# EAGLE design Trans Main Board ESP32 NEW Rev1.2 (EAGLE 9.6.2)
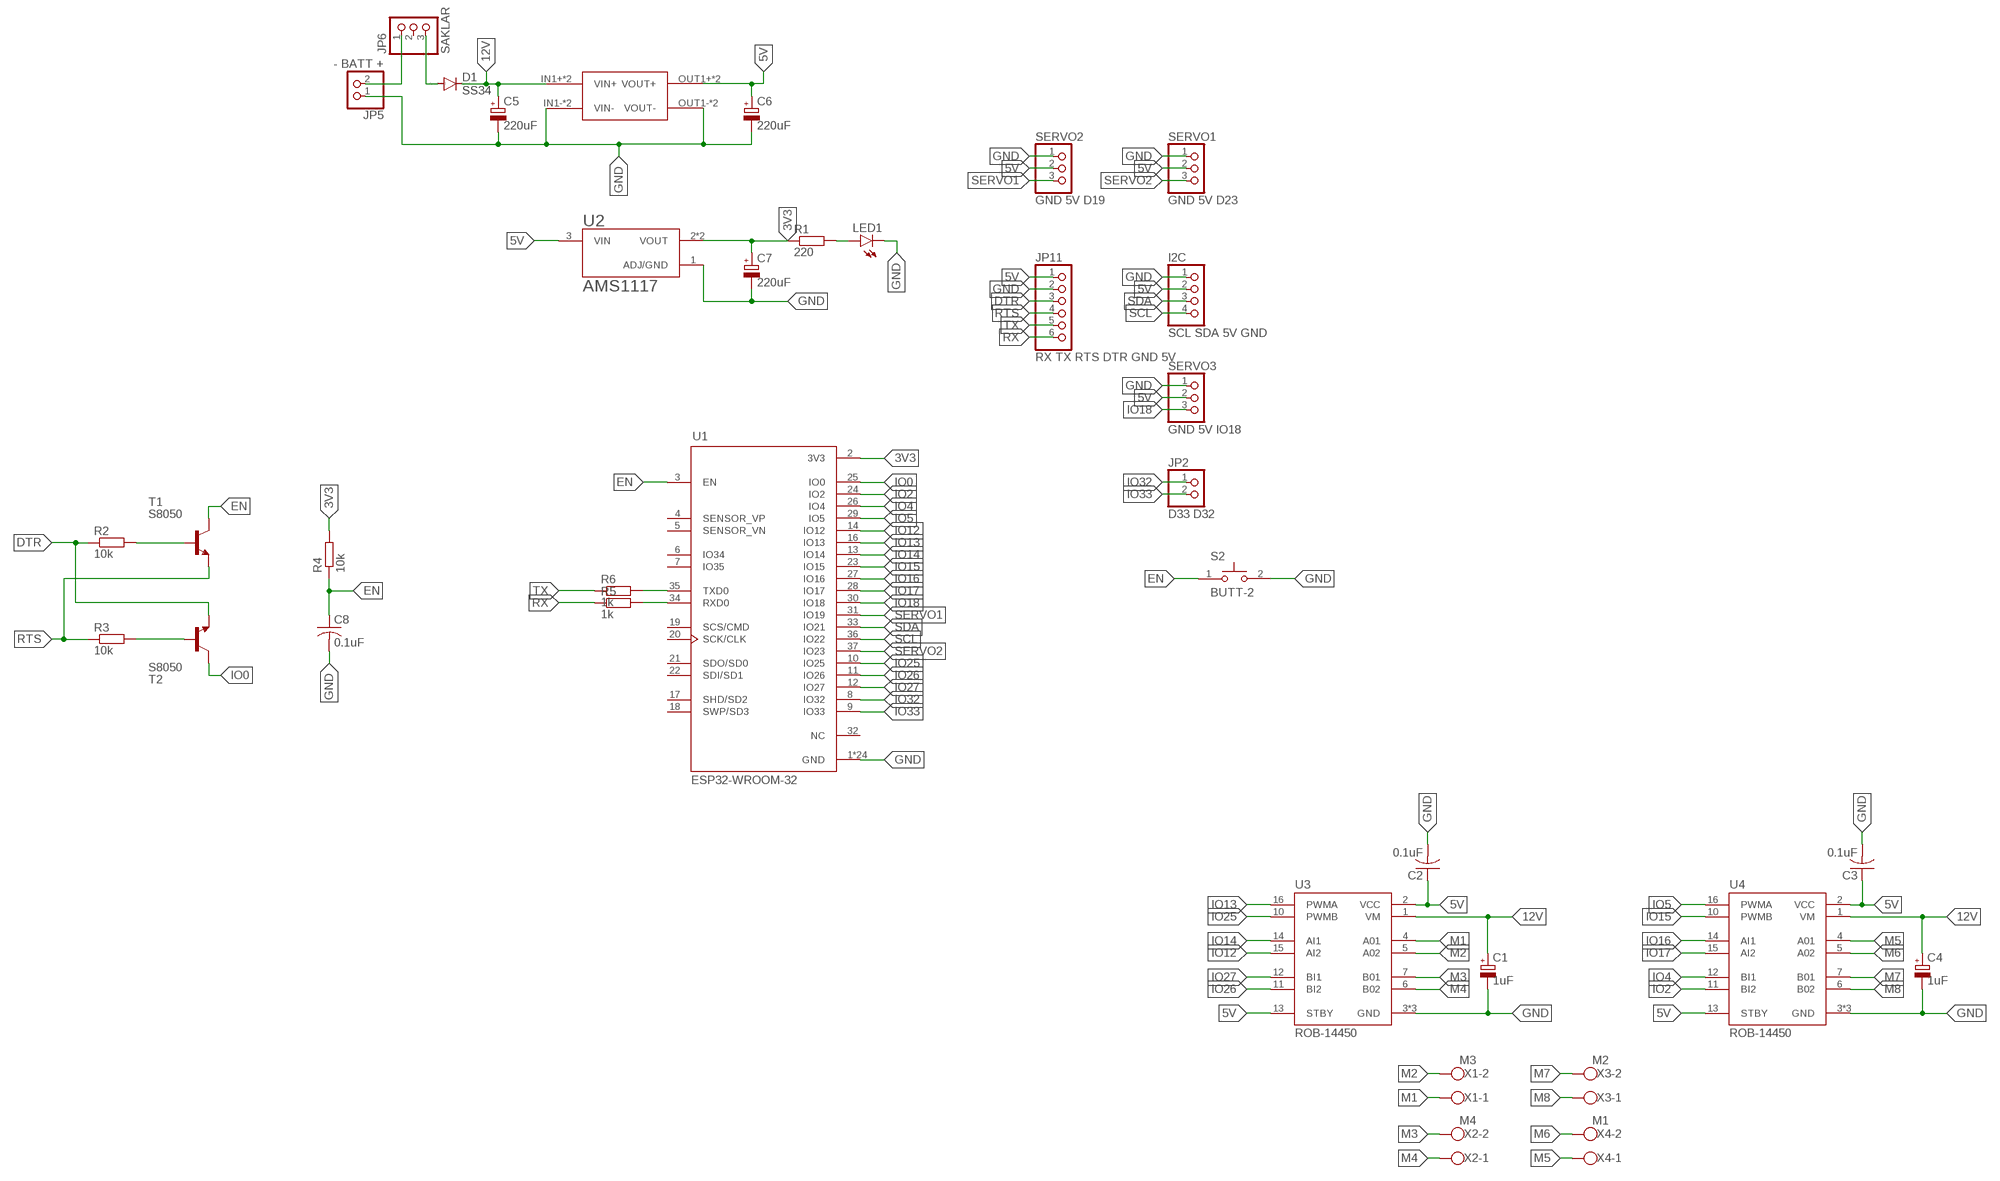
[diagram p0: schematic, sheet 1]

## Parts
C1  1uF  CPOL-EUE2-5  [E2-5]
C2  0.1uF  C-USC1206  [C1206]
C3  0.1uF  C-USC1206  [C1206]
C4  1uF  CPOL-EUE2-5  [E2-5]
C5  220uF  CPOL-EUE2-5  [E2-5]
C6  220uF  CPOL-EUE2-5  [E2-5]
C7  220uF  CPOL-EUE2-5  [E2-5]
C8  0.1uF  C-USC1206  [C1206]
D1  SS34  DIODE-DO-214AC  [DO-214AC]
I2C  SCL SDA 5V GND  PINHD-1X4  [1X04]
JP2  D33 D32  PINHD-1X2  [1X02]
JP5  - BATT +  PINHD-1X2  [1X02]
JP6  SAKLAR  PINHD-1X3  [1X03]
JP11  RX TX RTS DTR GND 5V  PINHD-1X6  [1X06]
LED1  LEDCHIPLED_1206  [CHIPLED_1206]
R1  220  R-EU_R1206  [R1206]
R2  10k  R-EU_R1206  [R1206]
R3  10k  R-EU_R1206  [R1206]
R4  10k  R-EU_R1206  [R1206]
R5  1k  R-EU_R1206  [R1206]
R6  1k  R-EU_R1206  [R1206]
S2  BUTT-2  [SW_BUTT-2]
SERVO1  GND 5V D23  PINHD-1X3  [1X03]
SERVO2  GND 5V D19  PINHD-1X3  [1X03]
SERVO3  GND 5V IO18  PINHD-1X3  [1X03]
T1  S8050  BC846  [SOT23]
T2  S8050  BC846  [SOT23]
U1  ESP32-WROOM-32  [MODULE_ESP32-WROOM-32]
U2  AMS1117  [SOT229P700X180-4N]
U3  ROB-14450  [MODULE_ROB-14450]
U4  ROB-14450  [MODULE_ROB-14450]
U$1  MP1584  [DC-BRICK]
X1  M3  W237-102  [W237-102]
X2  M4  W237-102  [W237-102]
X3  M2  W237-102  [W237-102]
X4  M1  W237-102  [W237-102]

## Nets
3V3: C7.+ R1.1 R4.2 U1.2(3V3) U2.2(VOUT) U2.4(VOUT)
5V: C2.1 C3.1 C6.+ I2C.2 JP11.1 SERVO1.2 SERVO2.2 SERVO3.2 U2.3(VIN) U3.2(VCC) U3.13(STBY) U4.2(VCC) U4.13(STBY) U$1.OUT1+(VOUT+) U$1.OUT2+(VOUT+)
12V: C1.+ C4.+ C5.+ D1.C U3.1(VM) U4.1(VM) U$1.IN1+(VIN+) U$1.IN2+(VIN+)
DTR: JP11.3 R2.1 T2.2(E)
EN: C8.1 R4.1 S2.1 T1.3(C) U1.3(EN)
GND: C1.- C2.2 C3.2 C4.- C5.- C6.- C7.- C8.2 I2C.1 JP5.1 JP11.2 LED1.C S2.2 SERVO1.1 SERVO2.1 SERVO3.1 U1.1(GND) U1.15(GND) U1.38(GND) U1.39_1(GND) U1.39_2(GND) U1.39_3(GND) U1.39_4(GND) U1.39_5(GND) U1.39_6(GND) U1.39_7(GND) U1.39_8(GND) U1.39_9(GND) U1.39_10(GND) U1.39_11(GND) U1.39_12(GND) U1.39_13(GND) U1.39_14(GND) U1.39_15(GND) U1.39_16(GND) U1.39_17(GND) U1.39_18(GND) U1.39_19(GND) U1.39_20(GND) U1.39_21(GND) U2.1(ADJ/GND) U3.3(GND) U3.8(GND) U3.9(GND) U4.3(GND) U4.8(GND) U4.9(GND) U$1.IN1-(VIN-) U$1.IN2-(VIN-) U$1.OUT1-(VOUT-) U$1.OUT2-(VOUT-)
IO0: T2.3(C) U1.25(IO0)
IO2: U1.24(IO2) U4.11(BI2)
IO4: U1.26(IO4) U4.12(BI1)
IO5: U1.29(IO5) U4.16(PWMA)
IO12: U1.14(IO12) U3.15(AI2)
IO13: U1.16(IO13) U3.16(PWMA)
IO14: U1.13(IO14) U3.14(AI1)
IO15: U1.23(IO15) U4.10(PWMB)
IO16: U1.27(IO16) U4.14(AI1)
IO17: U1.28(IO17) U4.15(AI2)
IO18: SERVO3.3 U1.30(IO18)
IO25: U1.10(IO25) U3.10(PWMB)
IO26: U1.11(IO26) U3.11(BI2)
IO27: U1.12(IO27) U3.12(BI1)
IO32: JP2.1 U1.8(IO32)
IO33: JP2.2 U1.9(IO33)
M1: U3.4(A01) X1.1
M2: U3.5(A02) X1.2
M3: U3.7(B01) X2.2
M4: U3.6(B02) X2.1
M5: U4.4(A01) X4.1
M6: U4.5(A02) X4.2
M7: U4.7(B01) X3.2
M8: U4.6(B02) X3.1
N$1: JP5.2 JP6.1
N$2: D1.A JP6.3
N$3: R2.2 T1.1(B)
N$4: R3.2 T2.1(B)
N$5: LED1.A R1.2
N$7: R6.2 U1.35(TXD0)
N$9: R5.2 U1.34(RXD0)
RTS: JP11.4 R3.1 T1.2(E)
RX: JP11.6 R5.1
SCL: I2C.4 U1.36(IO22)
SDA: I2C.3 U1.33(IO21)
SERVO1: SERVO2.3 U1.31(IO19)
SERVO2: SERVO1.3 U1.37(IO23)
TX: JP11.5 R6.1
Unconnected: JP6.2 U1.4(SENSOR_VP) U1.5(SENSOR_VN) U1.6(IO34) U1.7(IO35) U1.17(SHD/SD2) U1.18(SWP/SD3) U1.19(SCS/CMD) U1.20(SCK/CLK) U1.21(SDO/SD0) U1.22(SDI/SD1) U1.32(NC)

## Library data of the parts
C1 C4-C7 = rcl:CPOL-EU: POLARIZED CAPACITOR, European symbol; SPICEPREFIX: C
C2 C3 C8 = rcl:C-US: CAPACITOR, American symbol; SPICEPREFIX: C
D1 = diode:DIODE-: DIODE
I2C = pinhead:PINHD-1X4: PIN HEADER
JP2 JP5 = pinhead:PINHD-1X2: PIN HEADER
JP6 SERVO1-SERVO3 = pinhead:PINHD-1X3: PIN HEADER
JP11 = pinhead:PINHD-1X6: PIN HEADER
LED1 = led:LED: LED OSRAM: - CHIPLED LG R971, LG N971, LY N971, LG Q971, LY Q971, LO R971, LY R971 LH N974, LH R974 LS Q976, LO Q976, LY Q976 LO Q996 - Hyper CHIPLED LW Q18S LB Q993, LB Q99A, LB R99A - SideLED LS A670, LO A670, LY A670, LG A670, LP A670 LB A673, LV A673, LT A673, LW A673 LH A674 LY A675 LS A676, LA A676, LO A676, LY A676, LW A676 LS A679, LY A679, LG A679 - Hyper Micro SIDELED® LS Y876, LA Y876, LO Y876, LY Y876 LT Y87S - SmartLED LW L88C, LW L88S LB L89C, LB L89S, LG L890 LS L89K, LO L89K, LY L89K LS L896, LA L896, LO L896, LY L896 - TOPLED LS T670, LO T670, LY T670, LG T670, LP T670 LSG T670, LSP T670, LSY T670, LOP T670, LYG T670 LG T671, LOG T671, LSG T671 LB T673, LV T673, LT T673, LW T673 LH T674 LS T676, LA T676, LO T676, LY T676, LB T676, LH T676, LSB T676, LW T676 LB T67C, LV T67C, LT T67C, LS T67K, LO T67K, LY T67K, LW E67C LS E67B, LA E67B, LO E67B, LY E67B, LB E67C, LV E67C, LT E67C LW T67C LS T679, LY T679, LG T679 LS T770, LO T770, LY T770, LG T770, LP T770 LB T773, LV T773, LT T773, LW T773 LH T774 LS E675, LA E675, LY E675, LS T675 LS T776, LA T776, LO T776, LY T776, LB T776 LHGB T686 LT T68C, LB T68C - Hyper Mini TOPLED® LB M676 - Mini TOPLED Santana® LG M470 LS M47K, LO M47K, LY M47K Source: http://www.osram.convergy.de LUXEON: - LUMILED® LXK2-PW12-R00, LXK2-PW12-S00, LXK2-PW14-U00, LXK2-PW14-V00 LXK2-PM12-R00, LXK2-PM12-S00, LXK2-PM14-U00 LXK2-PE12-Q00, LXK2-PE12-R00, LXK2-PE12-S00, LXK2-PE14-T00, LXK2-PE14-U00 LXK2-PB12-K00, LXK2-PB12-L00, LXK2-PB12-M00, LXK2-PB14-N00, LXK2-PB14-P00, LXK2-PB14-Q00 LXK2-PR12-L00, LXK2-PR12-M00, LXK2-PR14-Q00, LXK2-PR14-R00 LXK2-PD12-Q00, LXK2-PD12-R00, LXK2-PD12-S00 LXK2-PH12-R00, LXK2-PH12-S00 LXK2-PL12-P00, LXK2-PL12-Q00, LXK2-PL12-R00 Source: www.luxeon.com KINGBRIGHT: KA-3528ASYC Source: www.kingbright.com
R1-R6 = rcl:R-EU_: RESISTOR, European symbol; SPICEPREFIX: R
S2 = BUTT-2:BUTT-2: Tactile Switches MINI PUSH BUTTON SWITCH 2-PIN QTY. 4 Check availability <https://pricing.snapeda.com/parts/BUTT-2/Gravitech/view-part?ref=eda>; AVAILABILITY: In Stock; DESCRIPTION: Tactile Switches MINI PUSH BUTTON SWITCH 2-PIN QTY. 4; MF: Gravitech; MP: BUTT-2; PACKAGE: None; PRICE: None; PURCHASE-URL: https://pricing.snapeda.com/search/part/BUTT-2/?ref=eda
T1 T2 = transistor:BC846: NPN TRANSISTOR
U1 = ESP32-WROOM-32:ESP32-WROOM-32: Check availability <https://pricing.snapeda.com/parts/ESP32-WROOM-32/Espressif%20Systems/view-part?ref=eda>; AVAILABILITY: In Stock; DESCRIPTION: Bluetooth, WiFi 802.11b/g/n, Bluetooth v4.2 +EDR, Class 1, 2 and 3 Transceiver Module 2.4GHz ~ 2.5GHz Antenna Not Included, U.FL Surface Mount; MF: Espressif Systems; MP: ESP32-WROOM-32; PACKAGE: Module Espressif Systems; PRICE: None; PURCHASE-URL: https://pricing.snapeda.com/search/part/ESP32-WROOM-32/?ref=eda
U2 = AMS1117:AMS1117: Sot223/Pkg 1-Amp 5-Volt Low Drop Out Voltage Regulatator Check availability <https://pricing.snapeda.com/parts/AMS1117/Advanced%20Monolithic%20Systems/view-part?ref=eda>; AVAILABILITY: Not in stock; DESCRIPTION: 1A LOW DROPOUT VOLTAGE REGULATOR SOT-223; MF: Advanced Monolithic Systems; MP: AMS1117; PACKAGE: SOT-223 Seeed Technology; PRICE: None
U3 U4 = ROB-14450:ROB-14450: TB6612FNG Motor Controller/Driver Power Management Evaluation Board Check availability <https://pricing.snapeda.com/parts/ROB-14450/SparkFun%20Electronics/view-part?ref=eda>; AVAILABILITY: In Stock; DESCRIPTION: TB6612FNG Motor Controller/Driver Power Management Evaluation Board; MF: SparkFun Electronics; MP: ROB-14450; PACKAGE: None; PRICE: None; PURCHASE-URL: https://pricing.snapeda.com/search/part/ROB-14450/?ref=eda
U$1 = MP1584-dc-brick:MP1584: MP1584-dc-brick-pcb Step down Input: 4.5V - 28V Ouput 0.8V - 25V max. 3A Cheap on ebay
X1-X4 = con-wago-500:W237-102: WAGO SCREW CLAMP; MPN: 237-102; OC_FARNELL: unknown; OC_NEWARK: 70K9898

## Board
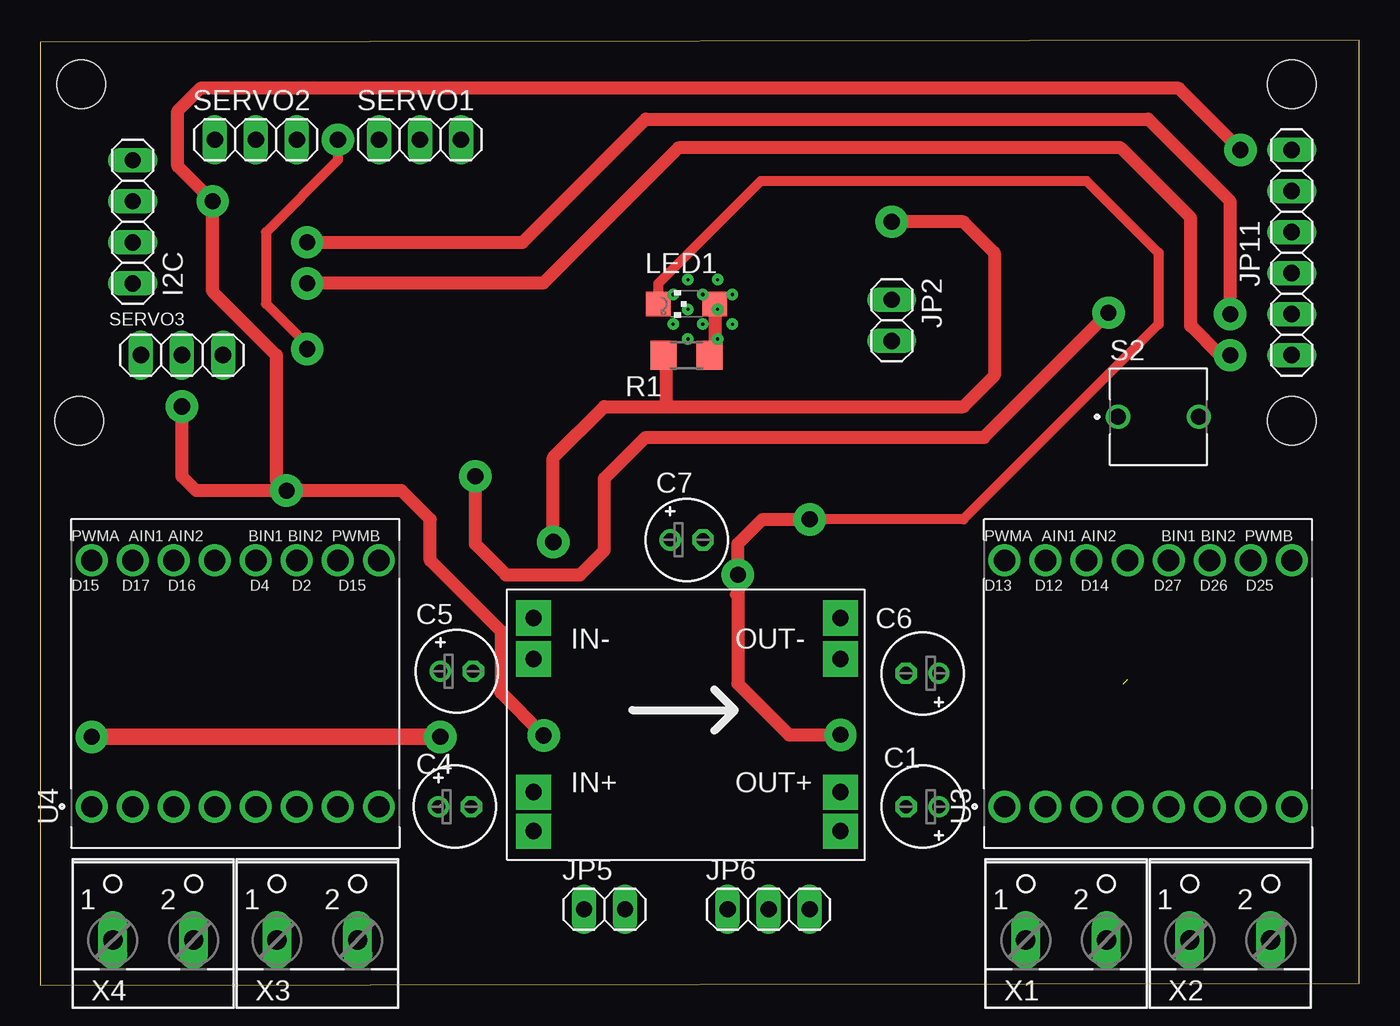
[diagram p1: board, top side]
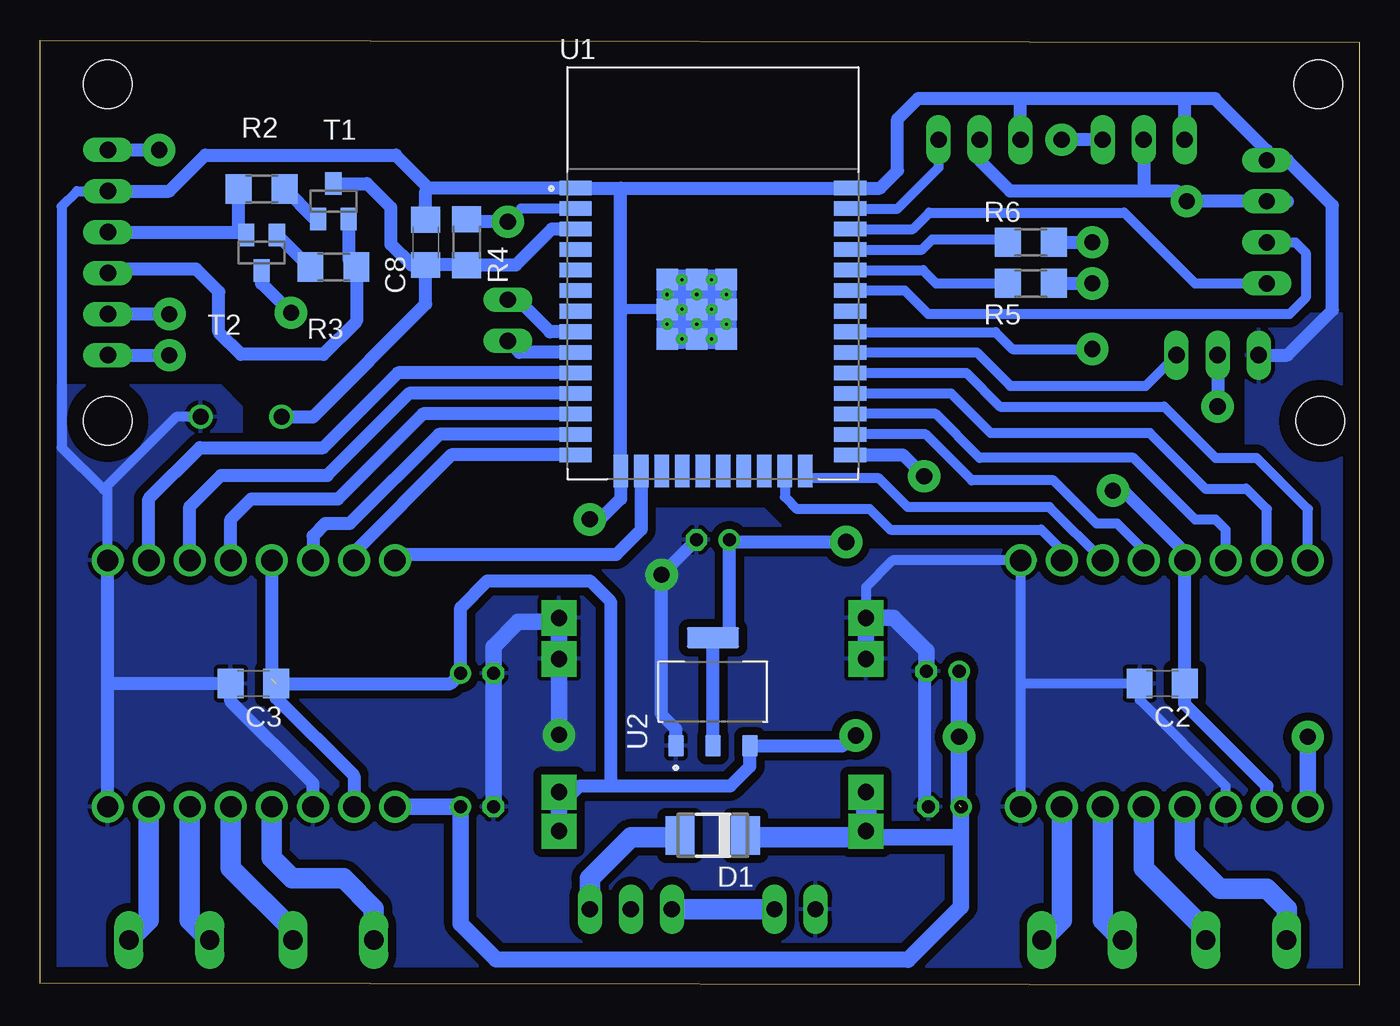
[diagram p2: board, bottom side, seen from below]

Size 81.64 x 58.47 mm. Coordinates in mm from the lower left corner, seen from the top.
Outline: 0,0 81.64,0.13 81.64,58.47 0,58.34 0,0
Copper layers (1*16): Top 0.035mm / dielectric 1.5mm / Bottom 0.035mm
Design rules "default *": minimum track width 24mil, minimum drill 1mm, track to track 20mil, track to pad 20mil, pad to pad 20mil, via to via 20mil, smd to smd 6mil, copper to edge 40mil, drill to drill 6mil, minimum pad ring 10mil, minimum via ring 8mil, stop-mask expansion 4mil, vias tented up to drill 0mil, thermal gap 10mil
Holes 3 mm at 2.54,55.75 2.41,34.92 77.47,34.92 77.47,55.75

### Footprints (pad centres in the part's own frame; a part is rotated, then mirrored left to right if it is on the bottom)
E2-5 = drill 0.813 pad 1.27: + -1.016,0 | drill 0.813 pad 1.27 octagon: - 1.016,0
C1206 = smd 1.6 x 1.8: 1 -1.4,0; 2 1.4,0
DO-214AC = smd 1.8 x 2.4: A 2.025,0; C -2.025,0
1X04 = drill 1.016 long: 1 -3.81,0; 2 -1.27,0; 3 1.27,0; 4 3.81,0
1X02 = drill 1.016 long: 1 -1.27,0; 2 1.27,0
1X03 = drill 1.016 long: 1 -2.54,0; 2 0,0; 3 2.54,0
1X06 = drill 1.016 long: 1 -6.35,0; 2 -3.81,0; 3 -1.27,0; 4 1.27,0; 5 3.81,0; 6 6.35,0
CHIPLED_1206 = smd 1.5 x 1.5: A 0,-1.75; C 0,1.75
R1206 = smd 1.6 x 1.803: 1 -1.422,0; 2 1.422,0
SW_BUTT-2 = drill 1: 1 -2.5,0; 2 2.5,0
SOT23 = smd 1 x 1.4: 1 -0.95,-1.1; 2 0.95,-1.1; 3 0,1.1
MODULE_ESP32-WROOM-32 = smd 2 x 0.9: 1 -8.5,5.26; 2 -8.5,3.99; 3 -8.5,2.72; 4 -8.5,1.45; 5 -8.5,0.18; 6 -8.5,-1.09; 7 -8.5,-2.36; 8 -8.5,-3.63; 9 -8.5,-4.9; 10 -8.5,-6.17; 11 -8.5,-7.44; 12 -8.5,-8.71; 13 -8.5,-9.98; 14 -8.5,-11.25; 25 8.5,-11.25; 26 8.5,-9.98; 27 8.5,-8.71; 28 8.5,-7.44; 29 8.5,-6.17; 30 8.5,-4.9; 31 8.5,-3.63; 32 8.5,-2.36; 33 8.5,-1.09; 34 8.5,0.18; 35 8.5,1.45; 36 8.5,2.72; 37 8.5,3.99; 38 8.5,5.26 | smd 0.9 x 2: 15 -5.715,-12.25; 16 -4.445,-12.25; 17 -3.175,-12.25; 18 -1.905,-12.25; 19 -0.635,-12.25; 20 0.635,-12.25; 21 1.905,-12.25; 22 3.175,-12.25; 23 4.445,-12.25; 24 5.715,-12.25 | smd 1.33 x 1.33: 39_1 -2.835,-0.405; 39_2 -1,-0.405; 39_3 0.835,-0.405; 39_4 -2.835,-2.24; 39_5 -1,-2.24; 39_6 0.835,-2.24; 39_7 -2.835,-4.075; 39_8 -1,-4.075; 39_9 0.835,-4.075 | drill 0.2 pad 0.3: 39_10 -1.917,-0.405; 39_11 -0.083,-0.405; 39_12 -2.835,-1.323; 39_13 -1,-1.323; 39_14 0.835,-1.323; 39_15 -1.917,-2.24; 39_16 -0.083,-2.24; 39_17 -2.835,-3.158; 39_18 -1,-3.158; 39_19 0.835,-3.158; 39_20 -1.917,-4.075; 39_21 -0.083,-4.075
SOT229P700X180-4N = smd 1.31 x 0.93: 1 -3.345,2.29; 2 -3.345,0; 3 -3.345,-2.29 | smd 1.31 x 3.24: 4 3.345,0
MODULE_ROB-14450 = drill 1.32: 1 -7.62,8.89; 2 -7.62,6.35; 3 -7.62,3.81; 4 -7.62,1.27; 5 -7.62,-1.27; 6 -7.62,-3.81; 7 -7.62,-6.35; 8 -7.62,-8.89; 9 7.62,-8.89; 10 7.62,-6.35; 11 7.62,-3.81; 12 7.62,-1.27; 13 7.62,1.27; 14 7.62,3.81; 15 7.62,6.35; 16 7.62,8.89
DC-BRICK = drill 1.016 pad 2.184 square: IN1+ 1.627,1.781; IN1- 1.627,12.438; IN2+ 1.627,4.197; IN2- 1.627,14.981; OUT1+ 20.627,1.781; OUT1- 20.627,12.438; OUT2+ 20.627,4.197; OUT2- 20.627,14.981
W237-102 = drill 1.194 long: 1 -2.5,-1.27; 2 2.5,-1.27

### Placement (x,y rotation side)
C1  54.61,11.05 180 top
C2  12.19,18.67 180 bottom
C3  68.45,18.67 180 bottom
C4  25.65,11.05 0 top
C5  25.78,19.43 0 top
C6  54.61,19.3 180 top
C7  40.01,27.56 0 top
C8  57.78,45.97 90 bottom
D1  40.01,9.27 180 bottom
I2C  5.71,47.24 270 top
JP2  52.7,41.15 270 top
JP5  34.92,4.7 0 top
JP6  45.09,4.7 0 top
JP11  77.47,45.34 270 top
LED1  40.01,42.16 90 top
R1  40.01,38.99 0 top
R2  67.94,49.28 0 bottom
R3  63.5,44.45 180 bottom
R4  55.24,45.97 90 bottom
R5  20.32,43.43 180 bottom
R6  20.32,45.97 180 bottom
S2  69.22,35.18 0 top
SERVO1  23.5,52.32 0 top
SERVO2  13.34,52.32 0 top
SERVO3  8.76,38.99 0 top
T1  63.5,48.51 0 bottom
T2  67.94,45.34 180 bottom
U1  40.01,44.07 0 bottom
U2  40.01,18.16 90 bottom
U3  68.58,18.67 90 top
U4  12.06,18.67 90 top
U$1  28.9,7.75 0 top
X1  63.5,4.06 0 top
X2  73.66,4.06 0 top
X3  17.14,4.06 0 top
X4  6.99,4.06 0 top

### Tracks (layer width: path | path; a pad name or v marks a point on that pad's centre or on a via)
3V3  (via drill 1 pad 2)
  Top 0.813: v31.75,27.43 31.75,32.64 34.92,35.81 38.73,35.81 | v52.7,47.24 57.15,47.24 59.05,45.34 59.05,37.72 57.15,35.81 38.73,35.81 | R1.1 38.73,38.84 38.73,35.81
  Bottom 0.61: R4.2 55.22,47.42 | U1.2 51.89,48.06 v52.7,47.24
  Bottom 0.813: 38.99,21.51 U2.4 | v31.75,27.43 38.86,27.43 C7.+ 38.99,21.89 39.37,21.51 U2.4 | U2.2 U2.4 | R4.2 55.09,47.24 v52.7,47.24
5V  (via drill 1 pad 2)  (1 unrouted)
  Top 0.813: v74.3,51.69 70.48,55.5 9.91,55.5 8.51,54.1 8.51,50.67 v10.67,48.51 10.67,42.93 14.61,38.99 14.61,31.24 v15.24,30.61 | v15.24,30.61 9.65,30.61 8.76,31.5 v8.76,35.81 | v31.16,15.45 28.51,18.1 28.51,21.91 24.13,26.29 24.13,28.83 22.35,30.61 v15.24,30.61
  Bottom 0.813: 46.35,12.32 38.94,12.32 37.72,13.55 U2.3 32,14.82 31.36,15.45 v31.16,15.45 31.11,15.49 | 46.35,12.32 48.26,12.32 49.3,11.28 U$1.OUT2+ | 46.35,12.32 46.35,23.75 47.62,25.02 53.98,25.02 55.63,23.37 C6.+ 56.26,18.67 C3.1 67.05,17.77 62.23,12.95 U3.2 | JP11.1 v74.3,51.69 | U3.13 67.31,18.93 | SERVO1.2 23.5,51.05 21.59,49.15 13.34,49.15 | SERVO2.2 13.34,49.15 | 4.45,48.51 I2C.2 v10.67,48.51 11.3,49.15 13.34,49.15 | SERVO3.2 v8.76,35.81 | v15.24,30.61 14.61,30.61 10.79,26.8 U4.13 C2.1 10.79,17.4 5.71,12.32 U4.2
  Bottom 1.016: U$1.OUT1+ U$1.OUT2+
12V  (via drill 1 pad 2)  (1 unrouted)
  Top 1.016: v24.77,15.37 v3.17,15.37
  Bottom 1.016: U$1.IN2+ 30.29,11.71 30.5,11.05 30.62,9.65 U$1.IN1+ | C5.+ v24.77,15.37 24.77,11.18 | 30.71,9.14 24.77,9.14 24.64,9.27 | 24.64,9.27 24.64,4.87 27.94,1.57 53.42,1.61 55.63,3.81 C1.+ U3.1 | U4.1 v3.17,15.37 | C4.+ 24.64,9.27
  Bottom 1.27: D1.C 37.85,9.14 30.71,9.14 30.5,9.36 30.5,11.05
DTR
  Bottom 0.813: 69.37,49 R2.1 69.37,46.91 T2.2 69.06,46.61 JP11.3
EN
  Bottom 0.813: C8.1 55.27,44.57 R4.1 55.22,44.58 52.2,44.58 49.98,46.79 U1.3 | 63.5,49.59 T1.3 61.42,49.61 59.94,48.13 59.94,45.85 58.67,44.57 C8.1 | C8.1 57.78,42.16 64.77,35.18 S2.1
GND  (via drill 1 pad 2)
  Top 0.61: 42.98,24.18 43.18,24.38 | LED1.C 38.26,43.43 44.6,49.78 64.77,49.78 69.22,45.34 69.22,40.89 57.15,28.83 v47.62,28.83
  Top 0.813: v47.62,28.83 44.7,28.83 43.18,27.3 v43.18,25.4 43.18,24.38 43.18,18.67 46.35,15.49 v49.53,15.49
  Bottom 0.61: JP11.2 79.38,49.15 80.32,48.2 80.32,33.27 77.73,30.68 73.23,35.18 S2.2 72.39,35.18 | U1.39_4 45.42,41.83 45.72,41.53 | 20.95,18.67 U4.9 28.88,26.29 30.53,24.64 U$1.IN2- | 20.95,18.67 U4.8 | 20.95,18.67 C2.2 13.59,17.65 8.26,12.32 U4.3 | U3.9 77.47,30.94
  Bottom 0.813: 45.72,49.33 U1.1 57.6,49.33 | 45.72,49.33 U1.38 29.66,49.33 28.57,50.42 28.57,53.59 27.3,54.86 20.95,54.86 | 45.72,49.33 45.72,41.53 U1.15 45.72,30.1 46.99,28.83 v47.62,28.83 | U2.1 42.3,15.84 43.18,16.73 v43.18,25.4 C7.- | C5.- 26.92,19.3 26.92,11.3 | C8.2 57.78,49.15 57.6,49.33 | JP11.2 73.66,49.15 71.44,51.37 59.65,51.37 57.6,49.33 | v49.53,15.49 49.71,15.67 | U3.8 77.47,18.67 | 77.47,18.67 U3.9 | U3.3 64.77,12.47 69.85,17.55 C3.2 77.47,18.67 | 10.79,54.86 8.93,54.86 5.71,51.65 I2C.1 4.45,51.05 1.65,48.26 1.65,41.78 4.45,38.99 SERVO3.1 | 10.79,54.86 20.95,54.86 | SERVO1.1 20.95,54.86 | SERVO2.1 10.79,54.86
  Bottom 1.016: 49.53,22.48 52.07,22.48 53.59,20.96 C6.- C1.- | v49.53,15.49 U$1.OUT1- U$1.OUT2- | C5.- 26.8,20.7 28.83,22.73 U$1.IN2- U$1.IN1-
  Bottom 1.27: U1.39_14 U1.39_3 U1.39_11 U1.39_2 | U1.39_19 U1.39_6 | U1.39_19 U1.39_9 U1.39_21 U1.39_8 | U1.39_20 U1.39_7 U1.39_17 | U1.39_17 U1.39_4 | U1.39_4 U1.39_12 | U1.39_12 U1.39_1 U1.39_10 U1.39_2 | U1.39_2 U1.39_13 | U1.39_14 U1.39_6 | U1.39_16 U1.39_6 | U1.39_13 U1.39_5 U1.39_18 | U1.39_15 U1.39_4 | U1.39_14 U1.39_13 | U1.39_12 U1.39_13 | U1.39_19 U1.39_18 | U1.39_17 U1.39_18
  pour Bottom: 0,0.25 0,41.53 5.71,41.53 6.99,40.26 6.99,26.92 34.29,26.92 36.83,29.46 43.81,29.46 46.99,26.29 65.41,26.29 69.22,30.1 69.22,35.81 70.48,37.08 81.92,37.08 81.92,0.25
IO0  (via drill 1 pad 2)
  Top 0.813: v26.92,31.5 26.92,27.3 28.83,25.4 33.4,25.4 34.92,26.92 34.92,31.37 37.47,33.91 58.42,33.91 v66.12,41.61
  Bottom 0.813: U1.25 28.25,32.82 v26.92,31.5 | T2.3 67.94,43.43 v66.12,41.61 66.12,41.57
IO2
  Bottom 0.61: U4.11 19.17,29.59 27.94,29.59 29.72,31.37 34.29,31.37 U1.24
IO4
  Bottom 0.61: U1.26 31.5,34.08 26.82,34.08 23.98,31.24 18.92,31.24 16.26,28.58 14.99,28.58 13.34,26.92 U4.12
IO5
  Bottom 0.61: U1.29 31.5,37.89 24.32,37.89 22.24,35.81 12.06,35.81 8.89,32.64 6.35,32.64 3.17,29.46 U4.16
IO12
  Bottom 0.813: U1.14 56.21,32.82 62.23,26.8 U3.15
IO13
  Bottom 0.813: U1.16 44.45,28.19 45.99,26.66 59.32,26.66 U3.16
IO14
  Bottom 0.813: U3.14 64.77,27.81 64.01,28.58 62.48,28.58 56.97,34.09 U1.13
IO15
  Bottom 0.61: U1.23 35.56,30.23 34.8,29.46 30.3,29.46 29.03,28.19 19.68,28.19 18.41,26.92 U4.10
IO16
  Bottom 0.61: U1.27 26.21,35.36 23.5,32.64 13.97,32.64 10.16,28.83 8.89,28.83 8.26,28.19 U4.14
IO17
  Bottom 0.61: U1.28 31.5,36.62 25.26,36.62 22.8,34.16 12.95,34.16 9.53,30.73 6.99,30.73 5.71,29.46 U4.15
IO18
  Bottom 0.61: U1.30 23.68,39.17 21.59,37.08 13.21,37.08 SERVO3.3
IO25
  Bottom 0.813: U1.10 59.51,37.9 64.14,33.27 71.75,33.27 74.93,30.1 U3.10
IO26
  Bottom 0.813: U3.11 72.39,29.62 70.46,31.55 63.88,31.55 58.8,36.63 U1.11
IO27
  Bottom 0.813: U3.12 69.85,28.83 68.58,30.1 63.21,30.1 57.95,35.36 U1.12
IO32
  Bottom 0.813: U1.8 50.09,40.44 52.07,42.42 JP2.1
IO33
  Bottom 0.813: U1.9 52,39.17 JP2.2
M1
  Bottom 1.27: X1.1 61,4.74 62.87,6.6 66.04,6.6 67.31,7.87 U3.4
M2
  Bottom 1.27: U3.5 69.85,7.24 66,3.39 X1.2
M3
  Bottom 1.27: U3.7 74.93,4.02 X2.2
M4
  Bottom 1.27: U3.6 72.39,4.02 X2.1
M5
  Bottom 1.27: U4.4 10.79,8.13 8.64,5.97 5.71,5.97 4.49,4.74 X4.1
M6
  Bottom 1.27: U4.5 13.34,7.24 9.48,3.39 X4.2
M7
  Bottom 1.27: U4.7 18.41,4.02 X3.2
M8
  Bottom 1.27: U4.6 15.88,4.02 X3.1
N$1
  Bottom 1.27: JP5.2 JP6.1
N$2
  Bottom 1.27: D1.A 42.16,9.14 45.09,9.14 47.62,6.6 JP6.3
N$3
  Bottom 0.813: T1.1 64.66,47.41 R2.2
N$4
  Bottom 0.813: T2.1 65.01,44.45 R3.2
N$5
  Top 0.813: LED1.A 41.76,39.32 R1.2
N$7
  Bottom 0.61: R6.2 21.92,46.15 26.43,46.15 27.06,45.52 U1.35
N$9
  Bottom 0.61: U1.34 27,44.25 26.19,43.43 R5.2
RTS
  Bottom 0.813: T1.2 62.55,44.92 R3.1 62.08,41.1 64.14,39.04 69.22,39.04 70.59,40.42 70.59,42.91 72.01,44.32 77.22,44.32 JP11.4
RX  (via drill 1 pad 2)
  Top 0.813: v73.66,38.99 73.03,38.99 71.21,40.8 71.21,47.49 66.88,51.82 39.5,51.82 31.12,43.44 v16.52,43.44 v16.51,43.43
  Bottom 0.813: JP11.6 v73.66,38.99 | R5.1 v16.51,43.43
SCL
  Bottom 0.61: U1.36 27.63,46.79 26.61,47.81 14.54,47.81 10.16,43.43 I2C.4
SDA
  Bottom 0.61: 31.5,42.97 U1.33 28.12,42.98 26.67,41.53 4.32,41.53 3.3,42.54 3.3,45.34 3.94,45.97 I2C.3
SERVO1  (via drill 1 pad 2)
  Top 0.61: v18.41,52.32 18.41,51.05 13.97,46.61 13.97,42.16 16.51,39.62 v16.51,39.37
  Bottom 0.61: U1.31 31.48,40.41 22.5,40.41 21.46,39.37 v16.51,39.37
  Bottom 0.813: SERVO2.3 v18.41,52.32
SERVO2
  Bottom 0.61: U1.37 28.57,48.06 26.04,50.6 SERVO1.3
TX  (via drill 1 pad 2)
  Top 0.813: v73.66,41.53 73.66,48.51 68.58,53.59 37.47,53.59 29.84,45.97 v16.51,45.97
  Bottom 0.813: v73.66,41.53 JP11.5 | R6.1 v16.51,45.97

### Text on the board
tPlace: PWMA AIN1 AIN2 BIN1 BIN2 PWMB / / / D15 D17 D16 D4 D2 D15 | PWMA AIN1 AIN2 BIN1 BIN2 PWMB / / / D13 D12 D14 D27 D26 D25